# Altium schematic sheet LO.SchDoc
size A4
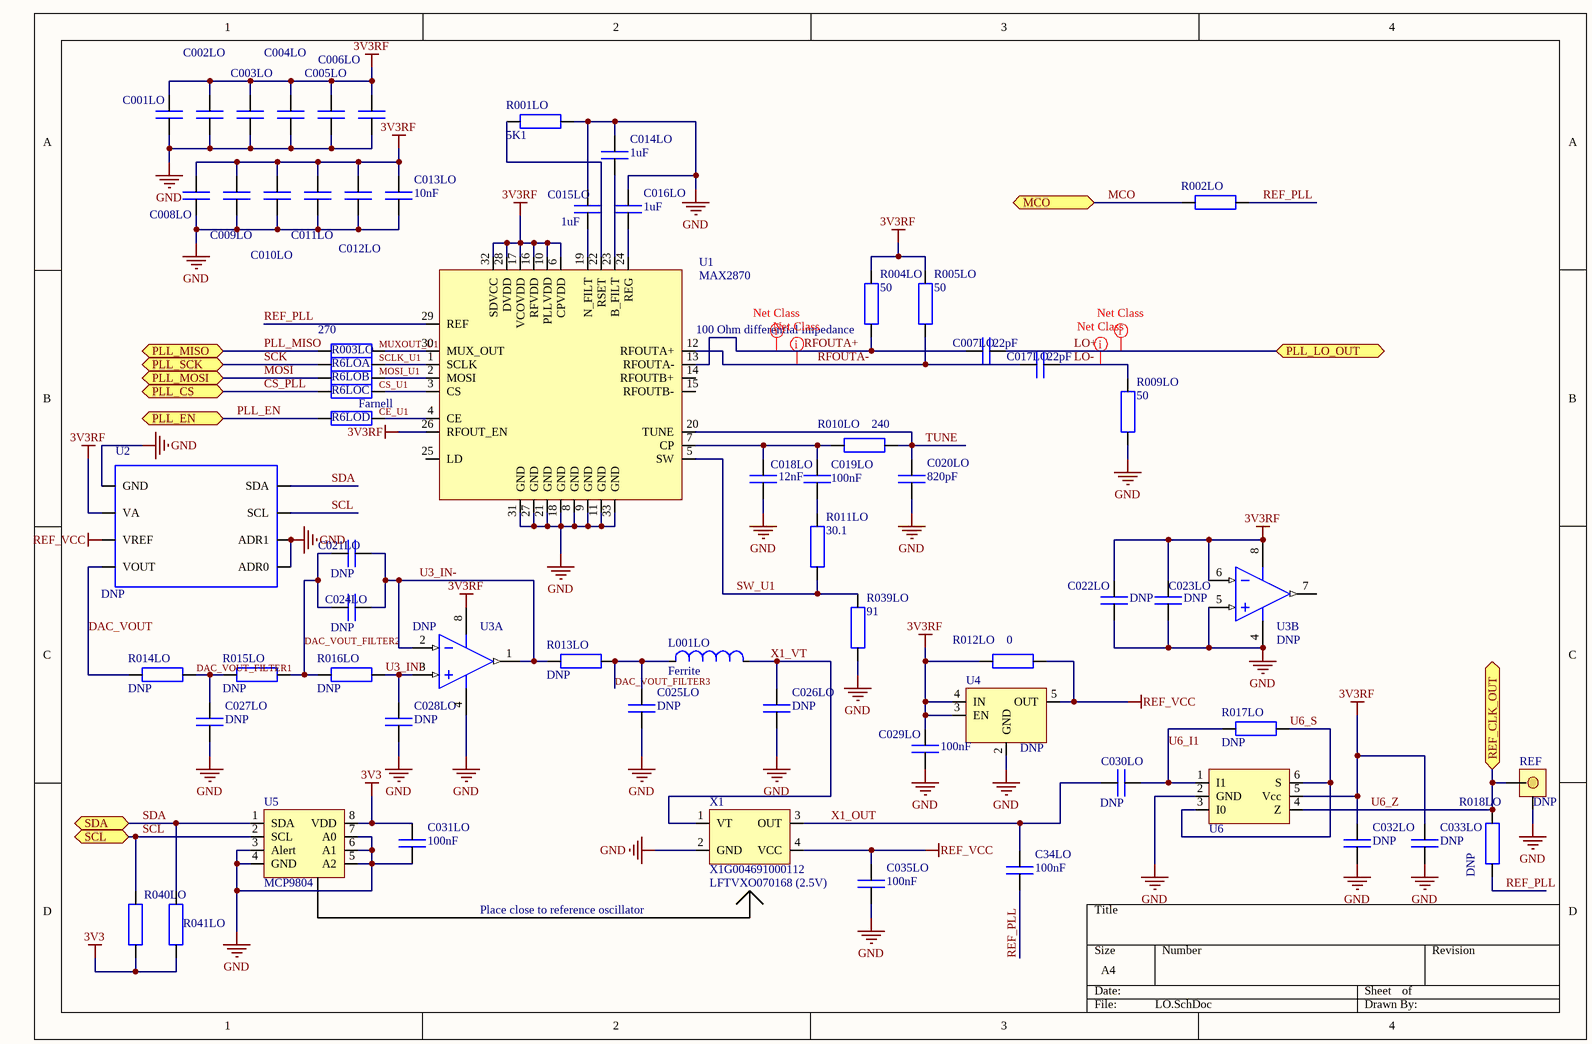
[diagram p0: LO.SchDoc]

## Parts
C001LO  100nF  [smd C0603_0.80]  (value not drawn)
C002LO  100nF  [smd C0603_0.80]  (value not drawn)
C003LO  100nF  [smd C0603_0.80]  (value not drawn)
C004LO  100nF  [smd C0603_0.80]  (value not drawn)
C005LO  100nF  [smd C0603_0.80]  (value not drawn)
C006LO  100nF  [smd C0603_0.80]  (value not drawn)
C007LO  22pF  [smd C0402]
C008LO  10nF  [smd C0402]  (value not drawn)
C009LO  10nF  [smd C0402]  (value not drawn)
C010LO  10nF  [smd C0402]  (value not drawn)
C011LO  10nF  [smd C0402]  (value not drawn)
C012LO  10nF  [smd C0402]  (value not drawn)
C013LO  10nF  [smd C0402]
C014LO  1uF  [smd C0603_0.80]
C015LO  1uF  [smd C0603_0.80]
C016LO  1uF  [smd C0603_0.80]
C017LO  22pF  [smd C0402]
C018LO  12nF  [smd C0603_0.80]
C019LO  100nF  [smd C0603_0.80]
C020LO  820pF  [smd C0603_0.80]
C021LO  DNP  [smd C0805_1.30]
C022LO  DNP  [smd C0402]
C023LO  DNP  [smd C0603_0.80]
C024LO  DNP  [smd C0805_1.30]
C025LO  DNP  [smd C0805_0.60]
C026LO  DNP  [smd C0805_0.60]
C027LO  DNP  [smd C0805_1.30]
C028LO  DNP  [smd C0805_0.60]
C029LO  100nF  [smd C0603_0.80]
C030LO  DNP  [smd C0603_0.80]
C031LO  100nF  [smd C0603_0.80]
C032LO  DNP  [smd C0603_0.80]
C033LO  DNP  [smd C0603_0.80]
C34LO  100nF  [smd C0603_0.80]
C035LO  100nF  [smd C0603_0.80]
L001LO  Ferrite  [smd C0805]
R001LO  5K1  [smd C0603_0.45]
R002LO  (no value)  [smd C0805_0.50]
R003LO  270  [smd C0805_0.50]
R004LO  50  [smd C0402_0.35]
R005LO  50  [smd C0402_0.35]
R6LO  DNP  [smd R EXB38v]  (value not drawn)  (parts A,B,C,D of 4)
R009LO  50  [smd C0402_0.35]
R010LO  240  [smd C0603_0.45]
R011LO  30.1  [smd C0603_0.45]
R012LO  0  [smd C0805_0.50]
R013LO  DNP  [smd C0603_0.45]
R014LO  DNP  [smd C0603_0.45]
R015LO  DNP  [smd C0603_0.45]
R016LO  DNP  [smd C0603_0.45]
R017LO  DNP  [smd C0603_0.45]
R018LO  DNP  [smd C0805_0.50]
R039LO  91  [smd C0603_0.45]
R040LO  (no value)  [smd C0805_0.50]
R041LO  (no value)  [smd C0805_0.50]
REF  DNP  [smd U.FL]
U1  MAX2870  [MAXIM-T3255]
U2  DNP  [smd MSOP/8]
U3  DNP  [smd soicn/8]  (parts A,B of 2)
U4  DNP  [SO23-5 TI]
U5  MCP9804  [smd MSOP/8]
U6  DNP  [SMD SC-70 (6-pin)]  (value not drawn)
X1  X1G004691000112  [X1G004691000112]

## Ports
MCO, PLL_CS, PLL_EN, PLL_LO_OUT, PLL_MISO, PLL_MOSI, PLL_SCK, REF_CLK_OUT, SCL, SDA

## Nets
3V3: C031LO.2 R040LO.2 R041LO.1 U5.8(VDD)
3V3RF: C001LO.2 C002LO.2 C003LO.2 C004LO.2 C005LO.2 C006LO.2 C008LO.2 C009LO.2 C010LO.2 C011LO.2 C012LO.2 C013LO.2 C022LO.2 C023LO.2 C029LO.2 C032LO.2 C033LO.2 R004LO.2 R005LO.2 R012LO.1 U1.6(CPVDD) U1.10(PLLVDD) U1.16(RFVDD) U1.17(VCOVDD) U1.26(RFOUT_EN) U1.28(DVDD) U1.32(SDVCC) U2.6(VA) U3.6(IN-) U3.8(V+) U4.3(EN) U4.4(IN) U6.5(Vcc)
GND: C001LO.1 C002LO.1 C003LO.1 C004LO.1 C005LO.1 C006LO.1 C008LO.1 C009LO.1 C010LO.1 C011LO.1 C012LO.1 C013LO.1 C014LO.1 C015LO.1 C016LO.1 C018LO.1 C020LO.1 C022LO.1 C023LO.1 C025LO.1 C026LO.1 C027LO.1 C028LO.1 C029LO.1 C031LO.1 C032LO.1 C033LO.1 C035LO.1 R001LO.1 R009LO.1 R039LO.1 REF.0 U1.8(GND) U1.9(GND) U1.11(GND) U1.18(GND) U1.21(GND) U1.27(GND) U1.31(GND) U1.33(GND) U2.1(ADR0) U2.2(ADR1) U2.5(GND) U3.4(V-) U3.5(IN+) U4.2(GND) U5.3(Alert) U5.4(GND) U5.5(A2) U5.6(A1) U5.7(A0) U6.2(GND) X1.2(GND)
REF_VCC: C035LO.2 R012LO.2 U2.7(VREF) U4.5(OUT) X1.4(VCC)
CS_PLL: R6LO.5 ; port PLL_CS
DAC_VOUT: R014LO.1 U2.8(VOUT)
DAC_VOUT_FILTER1: C027LO.2 R014LO.2 R015LO.1
DAC_VOUT_FILTER2: C021LO.2 C024LO.2 R015LO.2 R016LO.1
DAC_VOUT_FILTER3: C025LO.2 L001LO.1 R013LO.2
LO+: C007LO.2 ; port PLL_LO_OUT
LO-: C017LO.2 R009LO.2
MCO: R002LO.2 ; port MCO
MOSI: R6LO.3 ; port PLL_MOSI
PLL_EN: R6LO.7 ; port PLL_EN
PLL_MISO: R003LO.1 ; port PLL_MISO
REF_PLL: C34LO.2 R002LO.1 R018LO.1 U1.29(REF)
RFOUTA+: C007LO.1 R004LO.1 U1.13(RFOUTA-)
RFOUTA-: C017LO.1 R005LO.1 U1.12(RFOUTA+)
SCK: R6LO.1 ; port PLL_SCK
SCL: R040LO.1 U2.3(SCL) U5.2(SCL) ; port SCL
SDA: R041LO.2 U2.4(SDA) U5.1(SDA) ; port SDA
SW_U1: R011LO.1 R039LO.2 U1.5(SW)
TUNE: C020LO.2 R010LO.2 U1.20(TUNE)
U3_IN-: C021LO.1 C024LO.1 R013LO.1 U3.1(OUT) U3.2(IN-)
U3_INP: C028LO.2 R016LO.2 U3.3(IN+)
U6_I1: C030LO.1 R017LO.1 U6.1(I1)
U6_S: R017LO.2 U6.3(I0) U6.6(S)
U6_Z: R018LO.2 REF.1 U6.4(Z) ; port REF_CLK_OUT
X1_OUT: C030LO.2 C34LO.1 X1.3(OUT)
X1_VT: C026LO.2 L001LO.2 X1.1(VT)
NetC014LO_2: C014LO.2 U1.23(B_FILT)
NetC015LO_2: C015LO.2 U1.19(N_FILT)
NetC016LO_2: C016LO.2 U1.24(REG)
NetC018LO_2: C018LO.2 C019LO.2 R010LO.1 U1.7(CP)
NetC019LO_1: C019LO.1 R011LO.2
NetR001LO_2: R001LO.2 U1.22(RSET)
NetR003LO_2: R003LO.2 U1.30(MUX_OUT)
NetR6LO_2: R6LO.2 U1.1(SCLK)
NetR6LO_4: R6LO.4 U1.2(MOSI)
NetR6LO_6: R6LO.6 U1.3(CS)
NetR6LO_8: R6LO.8 U1.4(CE)

Not connected (* = marked no-connect by the designer): U1 14(RFOUTB+) 15(RFOUTB-) 25(LD); U3 7(OUT)

## Layout directives
net class RF: LO+, LO-, RFOUTA+, RFOUTA-

## Notes on the sheet
- (near R004LO) 100 Ohm differential impedance
- Place close to reference oscillator
- (near X1) LFTVXO070168 (2.5V)
- Labels drawn without touching a wire or pin: CE_U1, CS_U1, MOSI_U1, MUXOUT_U1, SCLK_U1

## Library data of the parts
C001LO C002LO C003LO C004LO C005LO C006LO C023LO C029LO C030LO C031LO C032LO C033LO C34LO C035LO = CSMD603/100nF: smd capaciteit, verp.0603, 100nF; Part Number: CSMD603/100nF; Component Kind: Standard; Component Type: Standard; Designator: CSMD603/100nF; Pin Count: 2; Supplier 1: Farnell
C007LO C017LO = CSMD402/22pF: smd capaciteit, verp.0402, 22pF; Part Number: CSMD402/22pF; Component Kind: Standard; Component Type: Standard; Designator: CSMD402/22pF; Pin Count: 2; Supplier 1: Farnell
C008LO C009LO C010LO C011LO C012LO C013LO C022LO = CSMD402/100nF: smd capaciteit, verp.0402, 10nF; Part Number: CSMD402/100nF; Component Kind: Standard; Component Type: Standard; Designator: CSMD402/100nF; Pin Count: 2; Supplier 1: Farnell
C014LO C015LO C016LO = CSMD603/1uF: smd capaciteit, verp.0603, 1uF; Part Number: CSMD603/18nF; Component Kind: Standard; Component Type: Standard; Designator: CSMD603/18nF; Library Reference: CSMD603/18nF; Pin Count: 2
C018LO C019LO C020LO = CSMD603/12nF: smd capaciteit, verp.0603, 12nF; Part Number: CSMD603/12nF; Component Kind: Standard; Component Type: Standard; Designator: CSMD603/12nF; Pin Count: 2
C021LO C024LO C027LO = CSMD805/1uF: smd capaciteit, verp.0805, 1uF
C025LO C026LO C028LO = CSMD805/330nF: smd capaciteit, verp.0805, 330nF; Part Number: CSMD805/330nF; Component Kind: Standard; Component Type: Standard; Designator: CSMD805/330nF; Pin Count: 2
L001LO = Ferrite 0805: Ferrite bead, 0805 package; Supplier 1: Farnell
R001LO = 5K1/603: weerstand SMD603, 5K1
R002LO R003LO R012LO R018LO = 270R/805: weerstand SMD805, 270R
R004LO R005LO R009LO = 47K/402: weerstand SMD402, 47K
R6LO = 22R/Network4/603: weerstandsnetwerk SMD603, 4x 22R; Supplier 1: Farnell
R010LO R011LO R039LO = 240K/603: weerstand SMD603, 240K
R013LO R014LO R015LO R016LO R017LO = 100K/603: weerstand SMD603, 100K; Supplier 1: Farnell
R040LO R041LO = 1K8/805: weerstand SMD805, 1K8
REF = CON HRS/SMA/ U.FL-R-SMT(01): connector Hirose, U.FL serie, U.FL-R-SMT(01); Supplier 1: Farnell
U2 = DAC081C085CIMM/NOPB: 12-Bit Micro Power DAC with I2C interface; Supplier 1: Farnell
U3 = MCP602-E/SN: Dual 2.7V to 6.0V Single Supply CMOS Op Amp
U4 = LM4120
U5 = MCP9804: ±0.25°C Typical Accuracy Digital Temperature Sensor; Supplier 1: Farnell
U6 = NC7SV157P6X: TinyLogic  2-Input Non-Inverting Multiplexer